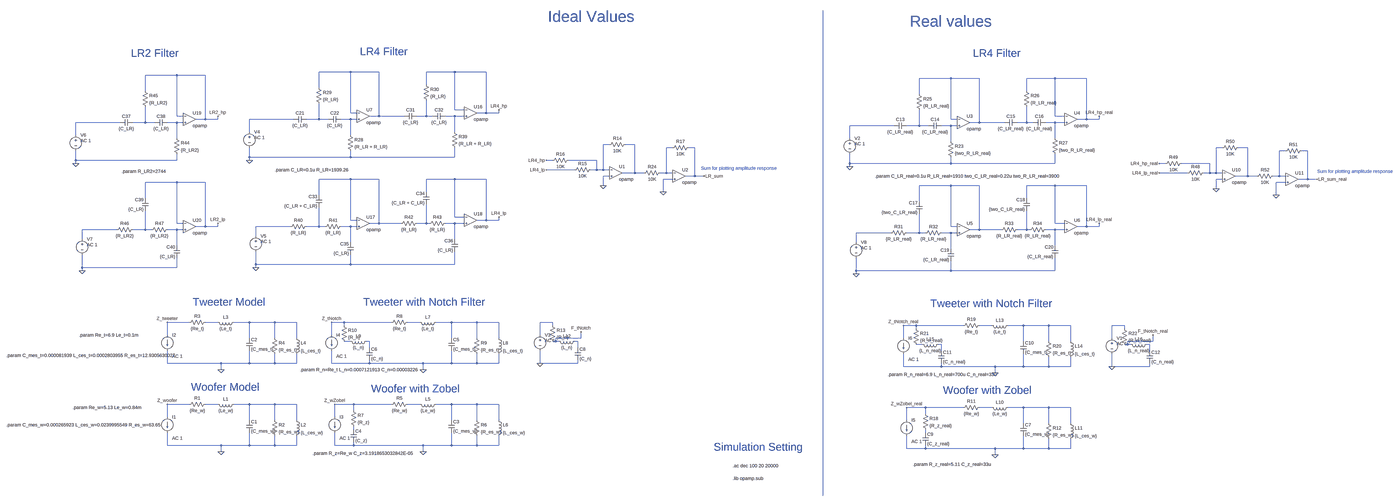
[diagram p0: schematic InfiniteBaffle.asc, whole sheet]
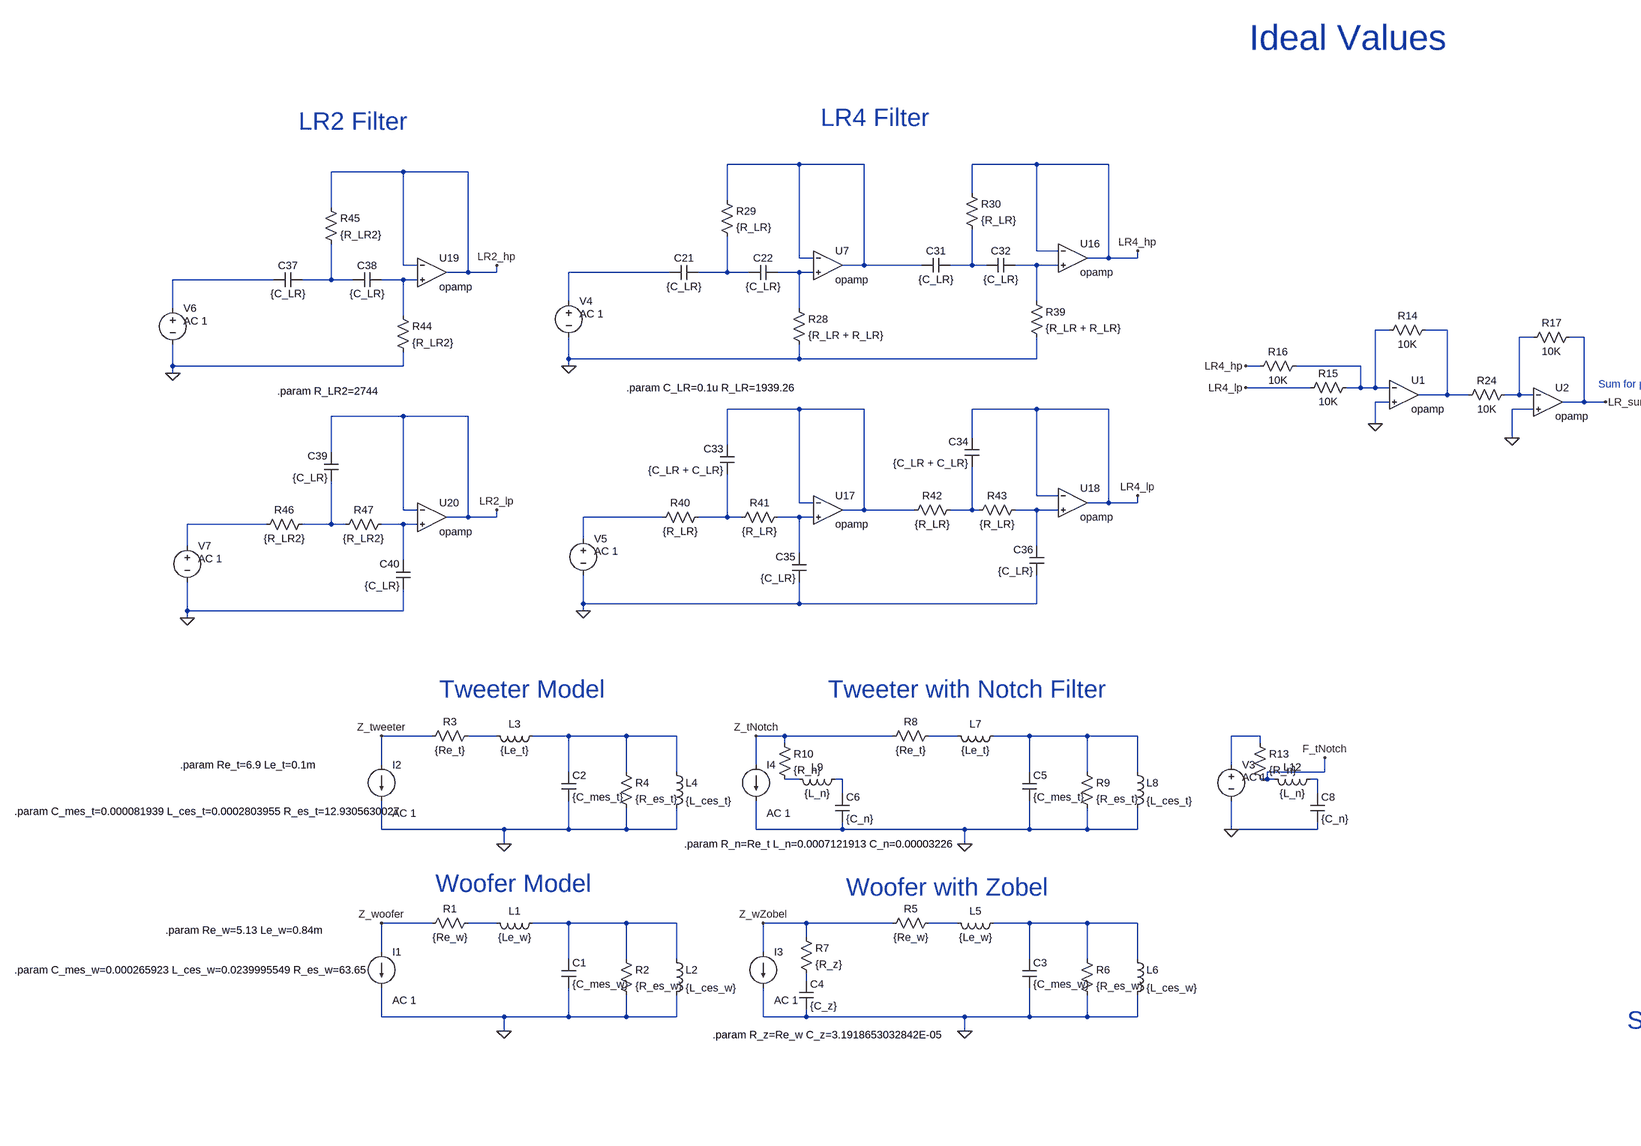
[diagram p1: schematic InfiniteBaffle.asc, part, row 1 of 1, column 1 of 2]
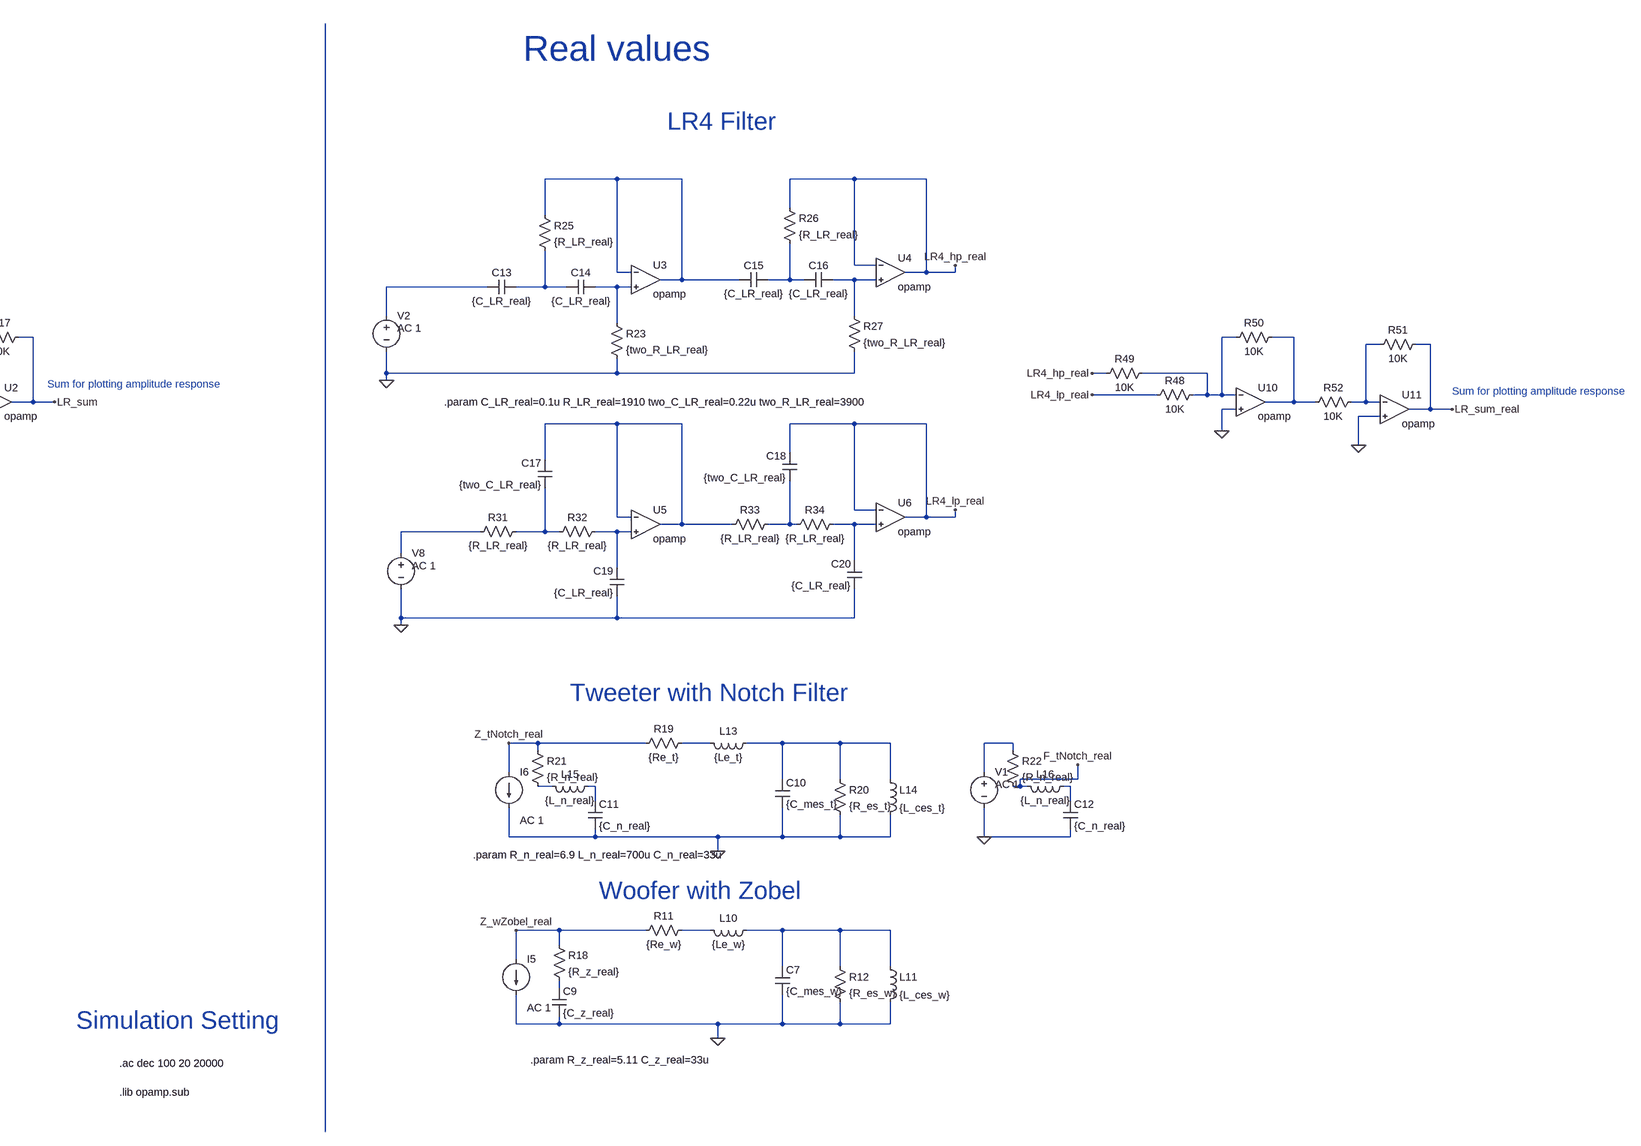
[diagram p2: schematic InfiniteBaffle.asc, part, row 1 of 1, column 2 of 2]
InfiniteBaffle.asc, the LTspice schematic file:
Version 4
SHEET 1 7228 996
WIRE -1888 -1280 -2048 -1280
WIRE -1744 -1280 -1888 -1280
WIRE -1360 -1280 -1504 -1280
WIRE -1200 -1280 -1360 -1280
WIRE -2768 -1264 -2928 -1264
WIRE -2624 -1264 -2768 -1264
WIRE 1312 -1248 1152 -1248
WIRE 1456 -1248 1312 -1248
WIRE 1840 -1248 1696 -1248
WIRE 2000 -1248 1840 -1248
WIRE -1504 -1216 -1504 -1280
WIRE -2048 -1200 -2048 -1280
WIRE -2928 -1184 -2928 -1264
WIRE 1696 -1184 1696 -1248
WIRE 1152 -1168 1152 -1248
WIRE -1360 -1088 -1360 -1280
WIRE -1312 -1088 -1360 -1088
WIRE -1888 -1072 -1888 -1280
WIRE -1856 -1072 -1888 -1072
WIRE -1200 -1072 -1200 -1280
WIRE -1200 -1072 -1248 -1072
WIRE -1136 -1072 -1136 -1088
WIRE -1136 -1072 -1200 -1072
WIRE -2768 -1056 -2768 -1264
WIRE -2736 -1056 -2768 -1056
WIRE -1744 -1056 -1744 -1280
WIRE -1744 -1056 -1792 -1056
WIRE -1616 -1056 -1744 -1056
WIRE -1504 -1056 -1504 -1136
WIRE -1504 -1056 -1552 -1056
WIRE -1472 -1056 -1504 -1056
WIRE -1360 -1056 -1408 -1056
WIRE -1312 -1056 -1360 -1056
WIRE 1840 -1056 1840 -1248
WIRE 1888 -1056 1840 -1056
WIRE -2624 -1040 -2624 -1264
WIRE -2624 -1040 -2672 -1040
WIRE -2560 -1040 -2560 -1056
WIRE -2560 -1040 -2624 -1040
WIRE -2176 -1040 -2400 -1040
WIRE -2048 -1040 -2048 -1120
WIRE -2048 -1040 -2112 -1040
WIRE -2000 -1040 -2048 -1040
WIRE -1888 -1040 -1936 -1040
WIRE -1856 -1040 -1888 -1040
WIRE 1312 -1040 1312 -1248
WIRE 1344 -1040 1312 -1040
WIRE 2000 -1040 2000 -1248
WIRE 2000 -1040 1952 -1040
WIRE 2064 -1040 2064 -1056
WIRE 2064 -1040 2000 -1040
WIRE -3056 -1024 -3280 -1024
WIRE -2928 -1024 -2928 -1104
WIRE -2928 -1024 -2992 -1024
WIRE -2880 -1024 -2928 -1024
WIRE -2768 -1024 -2816 -1024
WIRE -2736 -1024 -2768 -1024
WIRE 1456 -1024 1456 -1248
WIRE 1456 -1024 1408 -1024
WIRE 1584 -1024 1456 -1024
WIRE 1696 -1024 1696 -1104
WIRE 1696 -1024 1648 -1024
WIRE 1728 -1024 1696 -1024
WIRE 1840 -1024 1792 -1024
WIRE 1888 -1024 1840 -1024
WIRE 1024 -1008 800 -1008
WIRE 1152 -1008 1152 -1088
WIRE 1152 -1008 1088 -1008
WIRE 1200 -1008 1152 -1008
WIRE 1312 -1008 1264 -1008
WIRE 1344 -1008 1312 -1008
WIRE -2400 -976 -2400 -1040
WIRE -1360 -976 -1360 -1056
WIRE -3280 -960 -3280 -1024
WIRE -1888 -960 -1888 -1040
WIRE -2768 -944 -2768 -1024
WIRE 800 -944 800 -1008
WIRE 1840 -944 1840 -1024
WIRE 1312 -928 1312 -1008
WIRE -576 -912 -608 -912
WIRE -448 -912 -496 -912
WIRE -256 -896 -288 -896
WIRE -144 -896 -176 -896
WIRE 2688 -896 2656 -896
WIRE 2816 -896 2768 -896
WIRE 3008 -880 2976 -880
WIRE 3120 -880 3088 -880
WIRE -2400 -848 -2400 -896
WIRE -1888 -848 -1888 -880
WIRE -1888 -848 -2400 -848
WIRE -1360 -848 -1360 -896
WIRE -1360 -848 -1888 -848
WIRE -3280 -832 -3280 -880
WIRE -2768 -832 -2768 -864
WIRE -2768 -832 -3280 -832
WIRE -2400 -832 -2400 -848
WIRE -864 -832 -896 -832
WIRE -640 -832 -784 -832
WIRE -3280 -816 -3280 -832
WIRE 800 -816 800 -864
WIRE 1312 -816 1312 -848
WIRE 1312 -816 800 -816
WIRE 1840 -816 1840 -864
WIRE 1840 -816 1312 -816
WIRE 2400 -816 2368 -816
WIRE 2624 -816 2480 -816
WIRE 800 -800 800 -816
WIRE -752 -784 -896 -784
WIRE -640 -784 -640 -832
WIRE -640 -784 -672 -784
WIRE -608 -784 -608 -912
WIRE -608 -784 -640 -784
WIRE -576 -784 -608 -784
WIRE -448 -768 -448 -912
WIRE -448 -768 -512 -768
WIRE -400 -768 -448 -768
WIRE -288 -768 -288 -896
WIRE -288 -768 -320 -768
WIRE -256 -768 -288 -768
WIRE 2512 -768 2368 -768
WIRE 2624 -768 2624 -816
WIRE 2624 -768 2592 -768
WIRE 2656 -768 2656 -896
WIRE 2656 -768 2624 -768
WIRE 2688 -768 2656 -768
WIRE -576 -752 -608 -752
WIRE -144 -752 -144 -896
WIRE -144 -752 -192 -752
WIRE -96 -752 -144 -752
WIRE 2816 -752 2816 -896
WIRE 2816 -752 2752 -752
WIRE 2864 -752 2816 -752
WIRE 2976 -752 2976 -880
WIRE 2976 -752 2944 -752
WIRE 3008 -752 2976 -752
WIRE -1888 -736 -2048 -736
WIRE -1744 -736 -1888 -736
WIRE -1360 -736 -1504 -736
WIRE -1200 -736 -1360 -736
WIRE -256 -736 -304 -736
WIRE 2688 -736 2656 -736
WIRE 3120 -736 3120 -880
WIRE 3120 -736 3072 -736
WIRE 3168 -736 3120 -736
WIRE -2768 -720 -2928 -720
WIRE -2624 -720 -2768 -720
WIRE 3008 -720 2960 -720
WIRE -608 -704 -608 -752
WIRE 1312 -704 1152 -704
WIRE 1456 -704 1312 -704
WIRE 1840 -704 1696 -704
WIRE 2000 -704 1840 -704
WIRE 2656 -688 2656 -736
WIRE -1504 -672 -1504 -736
WIRE -304 -672 -304 -736
WIRE -2048 -656 -2048 -736
WIRE 2960 -656 2960 -720
WIRE -2928 -640 -2928 -720
WIRE 1696 -640 1696 -704
WIRE 1152 -624 1152 -704
WIRE -1360 -544 -1360 -736
WIRE -1312 -544 -1360 -544
WIRE -1888 -528 -1888 -736
WIRE -1856 -528 -1888 -528
WIRE -1200 -528 -1200 -736
WIRE -1200 -528 -1248 -528
WIRE -1136 -528 -1136 -544
WIRE -1136 -528 -1200 -528
WIRE -2768 -512 -2768 -720
WIRE -2736 -512 -2768 -512
WIRE -1744 -512 -1744 -736
WIRE -1744 -512 -1792 -512
WIRE -1632 -512 -1744 -512
WIRE -1504 -512 -1504 -608
WIRE -1504 -512 -1552 -512
WIRE -1488 -512 -1504 -512
WIRE -1360 -512 -1408 -512
WIRE -1312 -512 -1360 -512
WIRE 1840 -512 1840 -704
WIRE 1888 -512 1840 -512
WIRE -2624 -496 -2624 -720
WIRE -2624 -496 -2672 -496
WIRE -2560 -496 -2560 -512
WIRE -2560 -496 -2624 -496
WIRE -2192 -496 -2368 -496
WIRE -2048 -496 -2048 -592
WIRE -2048 -496 -2112 -496
WIRE -2016 -496 -2048 -496
WIRE -1888 -496 -1936 -496
WIRE -1856 -496 -1888 -496
WIRE 1312 -496 1312 -704
WIRE 1344 -496 1312 -496
WIRE 2000 -496 2000 -704
WIRE 2000 -496 1952 -496
WIRE 2064 -496 2064 -512
WIRE 2064 -496 2000 -496
WIRE -3072 -480 -3248 -480
WIRE -2928 -480 -2928 -576
WIRE -2928 -480 -2992 -480
WIRE -2896 -480 -2928 -480
WIRE -2768 -480 -2816 -480
WIRE -2736 -480 -2768 -480
WIRE 1456 -480 1456 -704
WIRE 1456 -480 1408 -480
WIRE 1568 -480 1456 -480
WIRE 1696 -480 1696 -576
WIRE 1696 -480 1648 -480
WIRE 1712 -480 1696 -480
WIRE 1840 -480 1792 -480
WIRE 1888 -480 1840 -480
WIRE 1008 -464 832 -464
WIRE 1152 -464 1152 -560
WIRE 1152 -464 1088 -464
WIRE 1184 -464 1152 -464
WIRE 1312 -464 1264 -464
WIRE 1344 -464 1312 -464
WIRE -2368 -448 -2368 -496
WIRE -3248 -432 -3248 -480
WIRE -1360 -432 -1360 -512
WIRE -1888 -416 -1888 -496
WIRE 832 -416 832 -464
WIRE -2768 -400 -2768 -480
WIRE 1840 -400 1840 -480
WIRE 1312 -384 1312 -464
WIRE -2368 -304 -2368 -368
WIRE -1888 -304 -1888 -352
WIRE -1888 -304 -2368 -304
WIRE -1360 -304 -1360 -368
WIRE -1360 -304 -1888 -304
WIRE -3248 -288 -3248 -352
WIRE -2768 -288 -2768 -336
WIRE -2768 -288 -3248 -288
WIRE -2368 -288 -2368 -304
WIRE -3248 -272 -3248 -288
WIRE 832 -272 832 -336
WIRE 1312 -272 1312 -320
WIRE 1312 -272 832 -272
WIRE 1840 -272 1840 -336
WIRE 1840 -272 1312 -272
WIRE 832 -256 832 -272
WIRE -2704 112 -2816 112
WIRE -2560 112 -2624 112
WIRE -2400 112 -2480 112
WIRE -2272 112 -2400 112
WIRE -2160 112 -2272 112
WIRE -1920 112 -1984 112
WIRE -1680 112 -1920 112
WIRE -1536 112 -1600 112
WIRE -1376 112 -1456 112
WIRE -1248 112 -1376 112
WIRE -1136 112 -1248 112
WIRE -864 112 -928 112
WIRE -1920 128 -1920 112
WIRE -864 128 -864 112
WIRE 1136 128 1072 128
WIRE 1376 128 1136 128
WIRE 1520 128 1456 128
WIRE 1680 128 1600 128
WIRE 1808 128 1680 128
WIRE 1920 128 1808 128
WIRE 2192 128 2128 128
WIRE 1136 144 1136 128
WIRE 2192 144 2192 128
WIRE -2816 176 -2816 112
WIRE -1984 176 -1984 112
WIRE -928 176 -928 112
WIRE -2400 192 -2400 112
WIRE -2272 192 -2272 112
WIRE -2160 192 -2160 112
WIRE -1376 192 -1376 112
WIRE -1248 192 -1248 112
WIRE -1136 192 -1136 112
WIRE -720 192 -720 160
WIRE -720 192 -848 192
WIRE 1072 192 1072 128
WIRE 2128 192 2128 128
WIRE -1888 208 -1920 208
WIRE -1792 208 -1808 208
WIRE -848 208 -848 192
WIRE -848 208 -864 208
WIRE -832 208 -848 208
WIRE -736 208 -752 208
WIRE 1680 208 1680 128
WIRE 1808 208 1808 128
WIRE 1920 208 1920 128
WIRE 2336 208 2336 176
WIRE 2336 208 2208 208
WIRE 1168 224 1136 224
WIRE 1264 224 1248 224
WIRE 2208 224 2208 208
WIRE 2208 224 2192 224
WIRE 2224 224 2208 224
WIRE 2320 224 2304 224
WIRE -1792 240 -1792 208
WIRE -736 240 -736 208
WIRE 1264 256 1264 224
WIRE 2320 256 2320 224
WIRE -2816 320 -2816 256
WIRE -2544 320 -2816 320
WIRE -2400 320 -2400 256
WIRE -2400 320 -2544 320
WIRE -2272 320 -2272 272
WIRE -2272 320 -2400 320
WIRE -2160 320 -2160 272
WIRE -2160 320 -2272 320
WIRE -1984 320 -1984 256
WIRE -1792 320 -1792 304
WIRE -1792 320 -1984 320
WIRE -1520 320 -1792 320
WIRE -1376 320 -1376 256
WIRE -1376 320 -1520 320
WIRE -1248 320 -1248 272
WIRE -1248 320 -1376 320
WIRE -1136 320 -1136 272
WIRE -1136 320 -1248 320
WIRE -928 320 -928 256
WIRE -736 320 -736 304
WIRE -736 320 -928 320
WIRE 1072 336 1072 272
WIRE 1264 336 1264 320
WIRE 1264 336 1072 336
WIRE 1536 336 1264 336
WIRE 1680 336 1680 272
WIRE 1680 336 1536 336
WIRE 1808 336 1808 288
WIRE 1808 336 1680 336
WIRE 1920 336 1920 288
WIRE 1920 336 1808 336
WIRE 2128 336 2128 272
WIRE 2320 336 2320 320
WIRE 2320 336 2128 336
WIRE -2544 352 -2544 320
WIRE -1520 352 -1520 320
WIRE 1536 368 1536 336
WIRE -2704 528 -2816 528
WIRE -2560 528 -2624 528
WIRE -2400 528 -2480 528
WIRE -2272 528 -2400 528
WIRE -2160 528 -2272 528
WIRE -1872 528 -1968 528
WIRE -1680 528 -1872 528
WIRE -1536 528 -1600 528
WIRE -1376 528 -1456 528
WIRE -1248 528 -1376 528
WIRE -1136 528 -1248 528
WIRE 1184 544 1088 544
WIRE 1376 544 1184 544
WIRE 1520 544 1456 544
WIRE 1680 544 1600 544
WIRE 1808 544 1680 544
WIRE 1920 544 1808 544
WIRE -1872 560 -1872 528
WIRE 1184 576 1184 544
WIRE -2816 592 -2816 528
WIRE -1968 592 -1968 528
WIRE -2400 608 -2400 528
WIRE -2272 608 -2272 528
WIRE -2160 608 -2160 528
WIRE -1376 608 -1376 528
WIRE -1248 608 -1248 528
WIRE -1136 608 -1136 528
WIRE 1088 608 1088 544
WIRE 1680 624 1680 544
WIRE 1808 624 1808 544
WIRE 1920 624 1920 544
WIRE -1872 656 -1872 640
WIRE 1184 672 1184 656
WIRE -2816 736 -2816 672
WIRE -2544 736 -2816 736
WIRE -2400 736 -2400 672
WIRE -2400 736 -2544 736
WIRE -2272 736 -2272 688
WIRE -2272 736 -2400 736
WIRE -2160 736 -2160 688
WIRE -2160 736 -2272 736
WIRE -1968 736 -1968 672
WIRE -1872 736 -1872 720
WIRE -1872 736 -1968 736
WIRE -1520 736 -1872 736
WIRE -1376 736 -1376 672
WIRE -1376 736 -1520 736
WIRE -1248 736 -1248 688
WIRE -1248 736 -1376 736
WIRE -1136 736 -1136 688
WIRE -1136 736 -1248 736
WIRE 1088 752 1088 688
WIRE 1184 752 1184 736
WIRE 1184 752 1088 752
WIRE 1536 752 1184 752
WIRE 1680 752 1680 688
WIRE 1680 752 1536 752
WIRE 1808 752 1808 704
WIRE 1808 752 1680 752
WIRE 1920 752 1920 704
WIRE 1920 752 1808 752
WIRE -2544 768 -2544 736
WIRE -1520 768 -1520 736
WIRE 1536 784 1536 752
WIRE 544 992 544 -1712
FLAG -2544 768 0
FLAG -2816 528 Z_woofer
FLAG -2544 352 0
FLAG -2816 112 Z_tweeter
FLAG -1520 768 0
FLAG -1968 528 Z_wZobel
FLAG -1520 352 0
FLAG -1984 112 Z_tNotch
FLAG -720 160 F_tNotch
FLAG -928 320 0
FLAG -2400 -832 0
FLAG -2368 -288 0
FLAG -3280 -816 0
FLAG -3248 -272 0
FLAG -2560 -1056 LR2_hp
FLAG -1136 -1088 LR4_hp
FLAG -2560 -512 LR2_lp
FLAG -1136 -544 LR4_lp
FLAG -896 -832 LR4_hp
FLAG -896 -784 LR4_lp
FLAG -608 -704 0
FLAG -304 -672 0
FLAG -96 -752 LR_sum
FLAG 1536 784 0
FLAG 1088 544 Z_wZobel_real
FLAG 1536 368 0
FLAG 1072 128 Z_tNotch_real
FLAG 2336 176 F_tNotch_real
FLAG 2128 336 0
FLAG 800 -800 0
FLAG 832 -256 0
FLAG 2064 -1056 LR4_hp_real
FLAG 2064 -512 LR4_lp_real
FLAG 2368 -816 LR4_hp_real
FLAG 2368 -768 LR4_lp_real
FLAG 2656 -688 0
FLAG 2960 -656 0
FLAG 3168 -736 LR_sum_real
SYMBOL ind -2464 512 R90
WINDOW 0 5 56 VBottom 2
WINDOW 3 32 56 VTop 2
SYMATTR InstName L1
SYMATTR Value {Le_w}
SYMBOL res -2608 512 R90
WINDOW 0 0 56 VBottom 2
WINDOW 3 32 56 VTop 2
SYMATTR InstName R1
SYMATTR Value {Re_w}
SYMBOL current -2816 592 R0
WINDOW 123 24 108 Left 2
WINDOW 39 0 0 Left 2
SYMATTR Value2 AC 1
SYMATTR InstName I1
SYMATTR Value ""
SYMBOL cap -2416 608 R0
SYMATTR InstName C1
SYMATTR Value {C_mes_w}
SYMBOL res -2288 592 R0
SYMATTR InstName R2
SYMATTR Value {R_es_w}
SYMBOL ind -2176 592 R0
SYMATTR InstName L2
SYMATTR Value {L_ces_w}
SYMBOL ind -2464 96 R90
WINDOW 0 5 56 VBottom 2
WINDOW 3 32 56 VTop 2
SYMATTR InstName L3
SYMATTR Value {Le_t}
SYMBOL res -2608 96 R90
WINDOW 0 0 56 VBottom 2
WINDOW 3 32 56 VTop 2
SYMATTR InstName R3
SYMATTR Value {Re_t}
SYMBOL current -2816 176 R0
WINDOW 123 24 108 Left 2
WINDOW 39 0 0 Left 2
SYMATTR Value2 AC 1
SYMATTR InstName I2
SYMATTR Value ""
SYMBOL cap -2416 192 R0
SYMATTR InstName C2
SYMATTR Value {C_mes_t}
SYMBOL res -2288 176 R0
SYMATTR InstName R4
SYMATTR Value {R_es_t}
SYMBOL ind -2176 176 R0
SYMATTR InstName L4
SYMATTR Value {L_ces_t}
SYMBOL ind -1440 512 R90
WINDOW 0 5 56 VBottom 2
WINDOW 3 32 56 VTop 2
SYMATTR InstName L5
SYMATTR Value {Le_w}
SYMBOL res -1584 512 R90
WINDOW 0 0 56 VBottom 2
WINDOW 3 32 56 VTop 2
SYMATTR InstName R5
SYMATTR Value {Re_w}
SYMBOL cap -1392 608 R0
SYMATTR InstName C3
SYMATTR Value {C_mes_w}
SYMBOL res -1264 592 R0
SYMATTR InstName R6
SYMATTR Value {R_es_w}
SYMBOL ind -1152 592 R0
SYMATTR InstName L6
SYMATTR Value {L_ces_w}
SYMBOL res -1888 544 R0
SYMATTR InstName R7
SYMATTR Value {R_z}
SYMBOL cap -1888 656 R0
SYMATTR InstName C4
SYMATTR Value {C_z}
SYMBOL current -1968 592 R0
WINDOW 123 24 108 Left 2
WINDOW 39 0 0 Left 2
SYMATTR Value2 AC 1
SYMATTR InstName I3
SYMATTR Value ""
SYMBOL ind -1440 96 R90
WINDOW 0 5 56 VBottom 2
WINDOW 3 32 56 VTop 2
SYMATTR InstName L7
SYMATTR Value {Le_t}
SYMBOL res -1584 96 R90
WINDOW 0 0 56 VBottom 2
WINDOW 3 32 56 VTop 2
SYMATTR InstName R8
SYMATTR Value {Re_t}
SYMBOL cap -1392 192 R0
SYMATTR InstName C5
SYMATTR Value {C_mes_t}
SYMBOL res -1264 176 R0
SYMATTR InstName R9
SYMATTR Value {R_es_t}
SYMBOL ind -1152 176 R0
SYMATTR InstName L8
SYMATTR Value {L_ces_t}
SYMBOL res -1936 112 R0
SYMATTR InstName R10
SYMATTR Value {R_n}
SYMBOL ind -1792 192 R90
WINDOW 0 5 56 VBottom 2
WINDOW 3 32 56 VTop 2
SYMATTR InstName L9
SYMATTR Value {L_n}
SYMBOL cap -1808 240 R0
SYMATTR InstName C6
SYMATTR Value {C_n}
SYMBOL current -1984 176 R0
WINDOW 123 24 108 Left 2
WINDOW 39 0 0 Left 2
SYMATTR Value2 AC 1
SYMATTR InstName I4
SYMATTR Value ""
SYMBOL res -880 112 R0
SYMATTR InstName R13
SYMATTR Value {R_n}
SYMBOL ind -736 192 R90
WINDOW 0 5 56 VBottom 2
WINDOW 3 32 56 VTop 2
SYMATTR InstName L12
SYMATTR Value {L_n}
SYMBOL cap -752 240 R0
SYMATTR InstName C8
SYMATTR Value {C_n}
SYMBOL voltage -928 160 R0
WINDOW 123 24 44 Left 2
WINDOW 39 0 0 Left 2
SYMATTR Value2 AC 1
SYMATTR InstName V3
SYMATTR Value ""
SYMBOL Opamps\\opamp -1824 -1120 R0
SYMATTR InstName U7
SYMBOL voltage -2400 -992 R0
WINDOW 123 24 44 Left 2
WINDOW 39 0 0 Left 2
SYMATTR Value2 AC 1
SYMATTR InstName V4
SYMATTR Value ""
SYMBOL cap -2112 -1056 R90
WINDOW 0 0 32 VBottom 2
WINDOW 3 32 32 VTop 2
SYMATTR InstName C21
SYMATTR Value {C_LR}
SYMBOL cap -1936 -1056 R90
WINDOW 0 0 32 VBottom 2
WINDOW 3 32 32 VTop 2
SYMATTR InstName C22
SYMATTR Value {C_LR}
SYMBOL res -1904 -976 R0
SYMATTR InstName R28
SYMATTR Value {R_LR + R_LR}
SYMBOL res -2064 -1216 R0
SYMATTR InstName R29
SYMATTR Value {R_LR}
SYMBOL cap -1552 -1072 R90
WINDOW 0 0 32 VBottom 2
WINDOW 3 32 32 VTop 2
SYMATTR InstName C31
SYMATTR Value {C_LR}
SYMBOL cap -1408 -1072 R90
WINDOW 0 0 32 VBottom 2
WINDOW 3 32 32 VTop 2
SYMATTR InstName C32
SYMATTR Value {C_LR}
SYMBOL res -1520 -1232 R0
SYMATTR InstName R30
SYMATTR Value {R_LR}
SYMBOL res -1376 -992 R0
SYMATTR InstName R39
SYMATTR Value {R_LR + R_LR}
SYMBOL Opamps\\opamp -1280 -1136 R0
SYMATTR InstName U16
SYMBOL Opamps\\opamp -1824 -576 R0
SYMATTR InstName U17
SYMBOL Opamps\\opamp -1280 -592 R0
SYMATTR InstName U18
SYMBOL cap -2032 -592 R180
WINDOW 0 24 56 Left 2
WINDOW 3 24 8 Left 2
SYMATTR InstName C33
SYMATTR Value {C_LR + C_LR}
SYMBOL cap -1488 -608 R180
WINDOW 0 24 56 Left 2
WINDOW 3 24 8 Left 2
SYMATTR InstName C34
SYMATTR Value {C_LR + C_LR}
SYMBOL cap -1872 -352 R180
WINDOW 0 24 56 Left 2
WINDOW 3 24 8 Left 2
SYMATTR InstName C35
SYMATTR Value {C_LR}
SYMBOL cap -1344 -368 R180
WINDOW 0 24 56 Left 2
WINDOW 3 24 8 Left 2
SYMATTR InstName C36
SYMATTR Value {C_LR}
SYMBOL res -2096 -512 R90
WINDOW 0 0 56 VBottom 2
WINDOW 3 32 56 VTop 2
SYMATTR InstName R40
SYMATTR Value {R_LR}
SYMBOL res -1920 -512 R90
WINDOW 0 0 56 VBottom 2
WINDOW 3 32 56 VTop 2
SYMATTR InstName R41
SYMATTR Value {R_LR}
SYMBOL res -1536 -528 R90
WINDOW 0 0 56 VBottom 2
WINDOW 3 32 56 VTop 2
SYMATTR InstName R42
SYMATTR Value {R_LR}
SYMBOL res -1392 -528 R90
WINDOW 0 0 56 VBottom 2
WINDOW 3 32 56 VTop 2
SYMATTR InstName R43
SYMATTR Value {R_LR}
SYMBOL voltage -2368 -464 R0
WINDOW 123 24 44 Left 2
WINDOW 39 0 0 Left 2
SYMATTR Value2 AC 1
SYMATTR InstName V5
SYMATTR Value ""
SYMBOL Opamps\\opamp -2704 -1104 R0
SYMATTR InstName U19
SYMBOL voltage -3280 -976 R0
WINDOW 123 24 44 Left 2
WINDOW 39 0 0 Left 2
SYMATTR Value2 AC 1
SYMATTR InstName V6
SYMATTR Value ""
SYMBOL cap -2992 -1040 R90
WINDOW 0 0 32 VBottom 2
WINDOW 3 32 32 VTop 2
SYMATTR InstName C37
SYMATTR Value {C_LR}
SYMBOL cap -2816 -1040 R90
WINDOW 0 0 32 VBottom 2
WINDOW 3 32 32 VTop 2
SYMATTR InstName C38
SYMATTR Value {C_LR}
SYMBOL res -2784 -960 R0
SYMATTR InstName R44
SYMATTR Value {R_LR2}
SYMBOL res -2944 -1200 R0
SYMATTR InstName R45
SYMATTR Value {R_LR2}
SYMBOL Opamps\\opamp -2704 -560 R0
SYMATTR InstName U20
SYMBOL cap -2912 -576 R180
WINDOW 0 24 56 Left 2
WINDOW 3 24 8 Left 2
SYMATTR InstName C39
SYMATTR Value {C_LR}
SYMBOL cap -2752 -336 R180
WINDOW 0 24 56 Left 2
WINDOW 3 24 8 Left 2
SYMATTR InstName C40
SYMATTR Value {C_LR}
SYMBOL res -2976 -496 R90
WINDOW 0 0 56 VBottom 2
WINDOW 3 32 56 VTop 2
SYMATTR InstName R46
SYMATTR Value {R_LR2}
SYMBOL res -2800 -496 R90
WINDOW 0 0 56 VBottom 2
WINDOW 3 32 56 VTop 2
SYMATTR InstName R47
SYMATTR Value {R_LR2}
SYMBOL voltage -3248 -448 R0
WINDOW 123 24 44 Left 2
WINDOW 39 0 0 Left 2
SYMATTR Value2 AC 1
SYMATTR InstName V7
SYMATTR Value ""
SYMBOL res -656 -800 R90
WINDOW 0 0 56 VBottom 2
WINDOW 3 32 56 VTop 2
SYMATTR InstName R15
SYMATTR Value 10K
SYMBOL res -768 -848 R90
WINDOW 0 0 56 VBottom 2
WINDOW 3 32 56 VTop 2
SYMATTR InstName R16
SYMATTR Value 10K
SYMBOL Opamps\\opamp -544 -832 R0
SYMATTR InstName U1
SYMBOL Opamps\\opamp -224 -816 R0
SYMATTR InstName U2
SYMBOL res -480 -928 R90
WINDOW 0 0 56 VBottom 2
WINDOW 3 32 56 VTop 2
SYMATTR InstName R14
SYMATTR Value 10K
SYMBOL res -160 -912 R90
WINDOW 0 0 56 VBottom 2
WINDOW 3 32 56 VTop 2
SYMATTR InstName R17
SYMATTR Value 10K
SYMBOL res -304 -784 R90
WINDOW 0 0 56 VBottom 2
WINDOW 3 32 56 VTop 2
SYMATTR InstName R24
SYMATTR Value 10K
SYMBOL ind 1616 528 R90
WINDOW 0 5 56 VBottom 2
WINDOW 3 32 56 VTop 2
SYMATTR InstName L10
SYMATTR Value {Le_w}
SYMBOL res 1472 528 R90
WINDOW 0 0 56 VBottom 2
WINDOW 3 32 56 VTop 2
SYMATTR InstName R11
SYMATTR Value {Re_w}
SYMBOL cap 1664 624 R0
SYMATTR InstName C7
SYMATTR Value {C_mes_w}
SYMBOL res 1792 608 R0
SYMATTR InstName R12
SYMATTR Value {R_es_w}
SYMBOL ind 1904 608 R0
SYMATTR InstName L11
SYMATTR Value {L_ces_w}
SYMBOL res 1168 560 R0
SYMATTR InstName R18
SYMATTR Value {R_z_real}
SYMBOL cap 1168 672 R0
SYMATTR InstName C9
SYMATTR Value {C_z_real}
SYMBOL current 1088 608 R0
WINDOW 123 24 108 Left 2
WINDOW 39 0 0 Left 2
SYMATTR Value2 AC 1
SYMATTR InstName I5
SYMATTR Value ""
SYMBOL ind 1616 112 R90
WINDOW 0 5 56 VBottom 2
WINDOW 3 32 56 VTop 2
SYMATTR InstName L13
SYMATTR Value {Le_t}
SYMBOL res 1472 112 R90
WINDOW 0 0 56 VBottom 2
WINDOW 3 32 56 VTop 2
SYMATTR InstName R19
SYMATTR Value {Re_t}
SYMBOL cap 1664 208 R0
SYMATTR InstName C10
SYMATTR Value {C_mes_t}
SYMBOL res 1792 192 R0
SYMATTR InstName R20
SYMATTR Value {R_es_t}
SYMBOL ind 1904 192 R0
SYMATTR InstName L14
SYMATTR Value {L_ces_t}
SYMBOL res 1120 128 R0
SYMATTR InstName R21
SYMATTR Value {R_n_real}
SYMBOL ind 1264 208 R90
WINDOW 0 5 56 VBottom 2
WINDOW 3 32 56 VTop 2
SYMATTR InstName L15
SYMATTR Value {L_n_real}
SYMBOL cap 1248 256 R0
SYMATTR InstName C11
SYMATTR Value {C_n_real}
SYMBOL current 1072 192 R0
WINDOW 123 24 108 Left 2
WINDOW 39 0 0 Left 2
SYMATTR Value2 AC 1
SYMATTR InstName I6
SYMATTR Value ""
SYMBOL res 2176 128 R0
SYMATTR InstName R22
SYMATTR Value {R_n_real}
SYMBOL ind 2320 208 R90
WINDOW 0 5 56 VBottom 2
WINDOW 3 32 56 VTop 2
SYMATTR InstName L16
SYMATTR Value {L_n_real}
SYMBOL cap 2304 256 R0
SYMATTR InstName C12
SYMATTR Value {C_n_real}
SYMBOL voltage 2128 176 R0
WINDOW 123 24 44 Left 2
WINDOW 39 0 0 Left 2
SYMATTR Value2 AC 1
SYMATTR InstName V1
SYMATTR Value ""
SYMBOL Opamps\\opamp 1376 -1088 R0
SYMATTR InstName U3
SYMBOL voltage 800 -960 R0
WINDOW 123 24 44 Left 2
WINDOW 39 0 0 Left 2
SYMATTR Value2 AC 1
SYMATTR InstName V2
SYMATTR Value ""
SYMBOL cap 1088 -1024 R90
WINDOW 0 0 32 VBottom 2
WINDOW 3 32 32 VTop 2
SYMATTR InstName C13
SYMATTR Value {C_LR_real}
SYMBOL cap 1264 -1024 R90
WINDOW 0 0 32 VBottom 2
WINDOW 3 32 32 VTop 2
SYMATTR InstName C14
SYMATTR Value {C_LR_real}
SYMBOL res 1296 -944 R0
SYMATTR InstName R23
SYMATTR Value {two_R_LR_real}
SYMBOL res 1136 -1184 R0
SYMATTR InstName R25
SYMATTR Value {R_LR_real}
SYMBOL cap 1648 -1040 R90
WINDOW 0 0 32 VBottom 2
WINDOW 3 32 32 VTop 2
SYMATTR InstName C15
SYMATTR Value {C_LR_real}
SYMBOL cap 1792 -1040 R90
WINDOW 0 0 32 VBottom 2
WINDOW 3 32 32 VTop 2
SYMATTR InstName C16
SYMATTR Value {C_LR_real}
SYMBOL res 1680 -1200 R0
SYMATTR InstName R26
SYMATTR Value {R_LR_real}
SYMBOL res 1824 -960 R0
SYMATTR InstName R27
SYMATTR Value {two_R_LR_real}
SYMBOL Opamps\\opamp 1920 -1104 R0
SYMATTR InstName U4
SYMBOL Opamps\\opamp 1376 -544 R0
SYMATTR InstName U5
SYMBOL Opamps\\opamp 1920 -560 R0
SYMATTR InstName U6
SYMBOL cap 1168 -560 R180
WINDOW 0 24 56 Left 2
WINDOW 3 24 8 Left 2
SYMATTR InstName C17
SYMATTR Value {two_C_LR_real}
SYMBOL cap 1712 -576 R180
WINDOW 0 24 56 Left 2
WINDOW 3 24 8 Left 2
SYMATTR InstName C18
SYMATTR Value {two_C_LR_real}
SYMBOL cap 1328 -320 R180
WINDOW 0 24 56 Left 2
WINDOW 3 24 8 Left 2
SYMATTR InstName C19
SYMATTR Value {C_LR_real}
SYMBOL cap 1856 -336 R180
WINDOW 0 24 56 Left 2
WINDOW 3 24 8 Left 2
SYMATTR InstName C20
SYMATTR Value {C_LR_real}
SYMBOL res 1104 -480 R90
WINDOW 0 0 56 VBottom 2
WINDOW 3 32 56 VTop 2
SYMATTR InstName R31
SYMATTR Value {R_LR_real}
SYMBOL res 1280 -480 R90
WINDOW 0 0 56 VBottom 2
WINDOW 3 32 56 VTop 2
SYMATTR InstName R32
SYMATTR Value {R_LR_real}
SYMBOL res 1664 -496 R90
WINDOW 0 0 56 VBottom 2
WINDOW 3 32 56 VTop 2
SYMATTR InstName R33
SYMATTR Value {R_LR_real}
SYMBOL res 1808 -496 R90
WINDOW 0 0 56 VBottom 2
WINDOW 3 32 56 VTop 2
SYMATTR InstName R34
SYMATTR Value {R_LR_real}
SYMBOL voltage 832 -432 R0
WINDOW 123 24 44 Left 2
WINDOW 39 0 0 Left 2
SYMATTR Value2 AC 1
SYMATTR InstName V8
SYMATTR Value ""
SYMBOL res 2608 -784 R90
WINDOW 0 0 56 VBottom 2
WINDOW 3 32 56 VTop 2
SYMATTR InstName R48
SYMATTR Value 10K
SYMBOL res 2496 -832 R90
WINDOW 0 0 56 VBottom 2
WINDOW 3 32 56 VTop 2
SYMATTR InstName R49
SYMATTR Value 10K
SYMBOL Opamps\\opamp 2720 -816 R0
SYMATTR InstName U10
SYMBOL Opamps\\opamp 3040 -800 R0
SYMATTR InstName U11
SYMBOL res 2784 -912 R90
WINDOW 0 0 56 VBottom 2
WINDOW 3 32 56 VTop 2
SYMATTR InstName R50
SYMATTR Value 10K
SYMBOL res 3104 -896 R90
WINDOW 0 0 56 VBottom 2
WINDOW 3 32 56 VTop 2
SYMATTR InstName R51
SYMATTR Value 10K
SYMBOL res 2960 -768 R90
WINDOW 0 0 56 VBottom 2
WINDOW 3 32 56 VTop 2
SYMATTR InstName R52
SYMATTR Value 10K
TEXT 48 840 Left 2 !.ac dec 100 20 20000
TEXT -3296 544 Left 2 !.param Re_w=5.13 Le_w=0.84m
TEXT -3632 632 Left 2 !.param C_mes_w=0.000265923 L_ces_w=0.0239995549 R_es_w=63.65
TEXT -3264 176 Left 2 !.param Re_t=6.9 Le_t=0.1m
TEXT -3632 280 Left 2 !.param C_mes_t=0.000081939 L_ces_t=0.0002803955 R_es_t=12.9305630027
TEXT -2688 8 Left 5 ;Tweeter Model
TEXT -2696 440 Left 5 ;Woofer Model
TEXT -2080 776 Left 2 !.param R_z=Re_w C_z=3.1918653032842E-05
TEXT -2144 352 Left 2 !.param R_n=Re_t L_n=0.0007121913 C_n=0.00003226
TEXT 48 904 Left 2 !.lib opamp.sub
TEXT -2272 -784 Left 2 !.param C_LR=0.1u R_LR=1939.26
TEXT -3048 -776 Left 2 !.param R_LR2=2744
TEXT 1120 832 Left 2 !.param R_z_real=5.11 C_z_real=33u
TEXT 992 376 Left 2 !.param R_n_real=6.9 L_n_real=700u C_n_real=33u
TEXT 928 -752 Left 2 !.param C_LR_real=0.1u R_LR_real=1910 two_C_LR_real=0.22u two_R_LR_real=3900
TEXT -1824 8 Left 5 ;Tweeter with Notch Filter
TEXT -1784 448 Left 5 ;Woofer with Zobel
TEXT -3000 -1376 Left 5 ;LR2 Filter
TEXT -1840 -1384 Left 5 ;LR4 Filter
TEXT -112 -792 Left 2 ;Sum for plotting amplitude response
TEXT 1208 16 Left 5 ;Tweeter with Notch Filter
TEXT 1272 456 Left 5 ;Woofer with Zobel
TEXT 1424 -1376 Left 5 ;LR4 Filter
TEXT 3168 -776 Left 2 ;Sum for plotting amplitude response
TEXT -48 744 Left 5 ;Simulation Setting
TEXT -888 -1680 Left 6 ;Ideal Values
TEXT 1104 -1656 Left 6 ;Real values

The netlist it stands for:
* InfiniteBaffle.asc
L1 N052 N051 {Le_w}
R1 N051 Z_woofer {Re_w}
I1 Z_woofer 0 AC 1
C1 N052 0 {C_mes_w}
R2 N052 0 {R_es_w}
L2 N052 0 {L_ces_w}
L3 N038 N037 {Le_t}
R3 N037 Z_tweeter {Re_t}
I2 Z_tweeter 0 AC 1
C2 N038 0 {C_mes_t}
R4 N038 0 {R_es_t}
L4 N038 0 {L_ces_t}
L5 N054 N053 {Le_w}
R5 N053 Z_wZobel {Re_w}
C3 N054 0 {C_mes_w}
R6 N054 0 {R_es_w}
L6 N054 0 {L_ces_w}
R7 Z_wZobel N057 {R_z}
C4 N057 0 {C_z}
I3 Z_wZobel 0 AC 1
L7 N040 N039 {Le_t}
R8 N039 Z_tNotch {Re_t}
C5 N040 0 {C_mes_t}
R9 N040 0 {R_es_t}
L8 N040 0 {L_ces_t}
R10 Z_tNotch N045 {R_n}
L9 N046 N045 {L_n}
C6 N046 0 {C_n}
I4 Z_tNotch 0 AC 1
R13 N041 F_tNotch {R_n}
L12 N047 F_tNotch {L_n}
C8 N047 0 {C_n}
V3 N041 0 AC 1
XU7 N001 N007 N001 opamp Aol=100K GBW=10Meg  ; pins invin noninvin out
V4 N005 0 AC 1
C21 N006 N005 {C_LR}
C22 N007 N006 {C_LR}
R28 N007 0 {R_LR + R_LR}
R29 N001 N006 {R_LR}
C31 N003 N001 {C_LR}
C32 N004 N003 {C_LR}
R30 LR4_hp N003 {R_LR}
R39 N004 0 {R_LR + R_LR}
XU16 LR4_hp N004 LR4_hp opamp Aol=100K GBW=10Meg  ; pins invin noninvin out
XU17 N022 N028 N022 opamp Aol=100K GBW=10Meg  ; pins invin noninvin out
XU18 LR4_lp N025 LR4_lp opamp Aol=100K GBW=10Meg  ; pins invin noninvin out
C33 N027 N022 {C_LR + C_LR}
C34 N024 LR4_lp {C_LR + C_LR}
C35 0 N028 {C_LR}
C36 0 N025 {C_LR}
R40 N027 N026 {R_LR}
R41 N028 N027 {R_LR}
R42 N024 N022 {R_LR}
R43 N025 N024 {R_LR}
V5 N026 0 AC 1
XU19 LR2_hp N010 LR2_hp opamp Aol=100K GBW=10Meg  ; pins invin noninvin out
V6 N008 0 AC 1
C37 N009 N008 {C_LR}
C38 N010 N009 {C_LR}
R44 N010 0 {R_LR2}
R45 LR2_hp N009 {R_LR2}
XU20 LR2_lp N031 LR2_lp opamp Aol=100K GBW=10Meg  ; pins invin noninvin out
C39 N030 LR2_lp {C_LR}
C40 0 N031 {C_LR}
R46 N030 N029 {R_LR2}
R47 N031 N030 {R_LR2}
V7 N029 0 AC 1
R15 N016 LR4_lp 10K
R16 N016 LR4_hp 10K
XU1 N016 0 N017 opamp Aol=100K GBW=10Meg  ; pins invin noninvin out
XU2 N018 0 LR_sum opamp Aol=100K GBW=10Meg  ; pins invin noninvin out
R14 N017 N016 10K
R17 LR_sum N018 10K
R24 N018 N017 10K
L10 N056 N055 {Le_w}
R11 N055 Z_wZobel_real {Re_w}
C7 N056 0 {C_mes_w}
R12 N056 0 {R_es_w}
L11 N056 0 {L_ces_w}
R18 Z_wZobel_real N058 {R_z_real}
C9 N058 0 {C_z_real}
I5 Z_wZobel_real 0 AC 1
L13 N043 N042 {Le_t}
R19 N042 Z_tNotch_real {Re_t}
C10 N043 0 {C_mes_t}
R20 N043 0 {R_es_t}
L14 N043 0 {L_ces_t}
R21 Z_tNotch_real N048 {R_n_real}
L15 N049 N048 {L_n_real}
C11 N049 0 {C_n_real}
I6 Z_tNotch_real 0 AC 1
R22 N044 F_tNotch_real {R_n_real}
L16 N050 F_tNotch_real {L_n_real}
C12 N050 0 {C_n_real}
V1 N044 0 AC 1
XU3 N002 N015 N002 opamp Aol=100K GBW=10Meg  ; pins invin noninvin out
V2 N013 0 AC 1
C13 N014 N013 {C_LR_real}
C14 N015 N014 {C_LR_real}
R23 N015 0 {two_R_LR_real}
R25 N002 N014 {R_LR_real}
C15 N011 N002 {C_LR_real}
C16 N012 N011 {C_LR_real}
R26 LR4_hp_real N011 {R_LR_real}
R27 N012 0 {two_R_LR_real}
XU4 LR4_hp_real N012 LR4_hp_real opamp Aol=100K GBW=10Meg  ; pins invin noninvin out
XU5 N023 N036 N023 opamp Aol=100K GBW=10Meg  ; pins invin noninvin out
XU6 LR4_lp_real N033 LR4_lp_real opamp Aol=100K GBW=10Meg  ; pins invin noninvin out
C17 N035 N023 {two_C_LR_real}
C18 N032 LR4_lp_real {two_C_LR_real}
C19 0 N036 {C_LR_real}
C20 0 N033 {C_LR_real}
R31 N035 N034 {R_LR_real}
R32 N036 N035 {R_LR_real}
R33 N032 N023 {R_LR_real}
R34 N033 N032 {R_LR_real}
V8 N034 0 AC 1
R48 N019 LR4_lp_real 10K
R49 N019 LR4_hp_real 10K
XU10 N019 0 N020 opamp Aol=100K GBW=10Meg  ; pins invin noninvin out
XU11 N021 0 LR_sum_real opamp Aol=100K GBW=10Meg  ; pins invin noninvin out
R50 N020 N019 10K
R51 LR_sum_real N021 10K
R52 N021 N020 10K
.ac dec 100 20 20000
.param Re_w=5.13 Le_w=0.84m
.param C_mes_w=0.000265923 L_ces_w=0.0239995549 R_es_w=63.65
.param Re_t=6.9 Le_t=0.1m
.param C_mes_t=0.000081939 L_ces_t=0.0002803955 R_es_t=12.9305630027
* Tweeter Model
* Woofer Model
.param R_z=Re_w C_z=3.1918653032842E-05
.param R_n=Re_t L_n=0.0007121913 C_n=0.00003226
.lib opamp.sub
.param C_LR=0.1u R_LR=1939.26
.param R_LR2=2744
.param R_z_real=5.11 C_z_real=33u
.param R_n_real=6.9 L_n_real=700u C_n_real=33u
.param C_LR_real=0.1u R_LR_real=1910 two_C_LR_real=0.22u two_R_LR_real=3900
* Tweeter with Notch Filter
* Woofer with Zobel
* LR2 Filter
* LR4 Filter
* Sum for plotting amplitude response
* Tweeter with Notch Filter
* Woofer with Zobel
* LR4 Filter
* Sum for plotting amplitude response
* Simulation Setting
* Ideal Values
* Real values
.backanno
.end

* Results of the author's LTspice run, read from the files saved beside the schematic
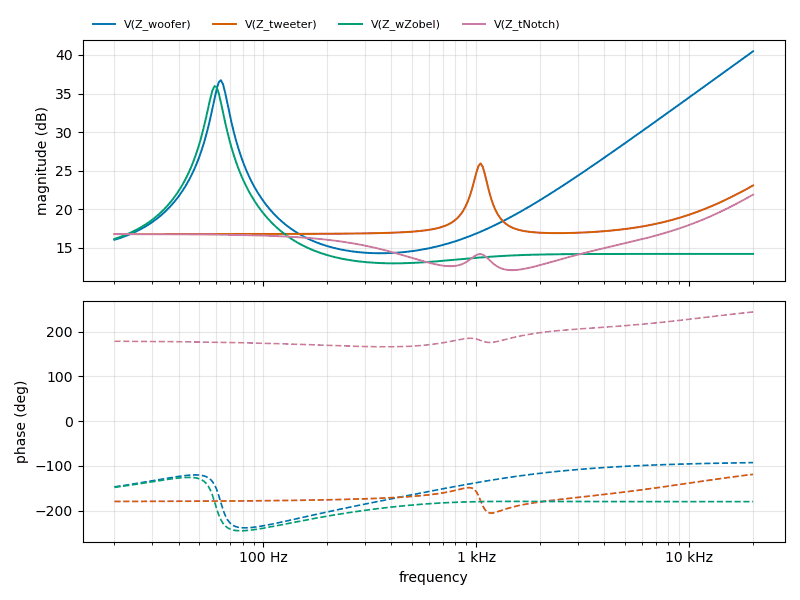
[diagram p3: AC Analysis of InfiniteBaffle.asc, plotted from the saved traces]
* AC Analysis, 1 run:
*   V(Z_woofer): 16.03 dB at 20 Hz, 40.48 dB at 20 kHz, peak 40.48 dB at 20 kHz, 3 dB below the peak at 14.13 kHz
*   V(Z_tweeter): 16.78 dB at 20 Hz, 23.08 dB at 20 kHz, peak 25.93 dB at 1.05 kHz, 3 dB below the peak at 962.9 Hz and 1.136 kHz
*   V(Z_wZobel): 16.14 dB at 20 Hz, 14.20 dB at 20 kHz, peak 35.96 dB at 59.02 Hz, 3 dB below the peak at 54.95 Hz and 64.26 Hz
*   V(Z_tNotch): 16.77 dB at 20 Hz, 21.89 dB at 20 kHz, peak 21.89 dB at 20 kHz, 3 dB below the peak at 12.15 kHz